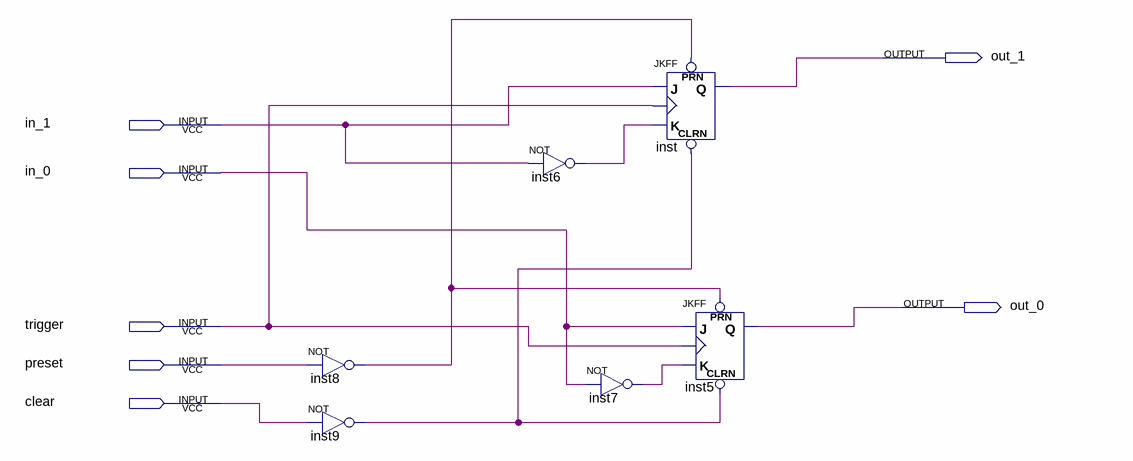
[diagram p0: schematic sheet]
// Quartus schematic reg2b.bdf as structural Verilog: 6 symbols, 7 pins
module reg2b (
  input  in_1,
  input  in_0,
  input  trigger,
  input  preset,
  input  clear,
  output out_1,
  output out_0
);

  wire inst6_out, inst7_out, inst8_out, inst9_out;

  not inst8 (inst8_out, preset);
  not inst9 (inst9_out, clear);
  not inst6 (inst6_out, in_1);
  not inst7 (inst7_out, in_0);
  JKFF inst (.PRN(inst8_out), .CLRN(inst9_out), .K(inst6_out), .J(in_1), .CLK(trigger), .Q(out_1));
  JKFF inst5 (.PRN(inst8_out), .CLRN(inst9_out), .K(inst7_out), .J(in_0), .CLK(trigger), .Q(out_0));
endmodule
